# EAGLE design Timer Settings Schematic (EAGLE 9.2.2)
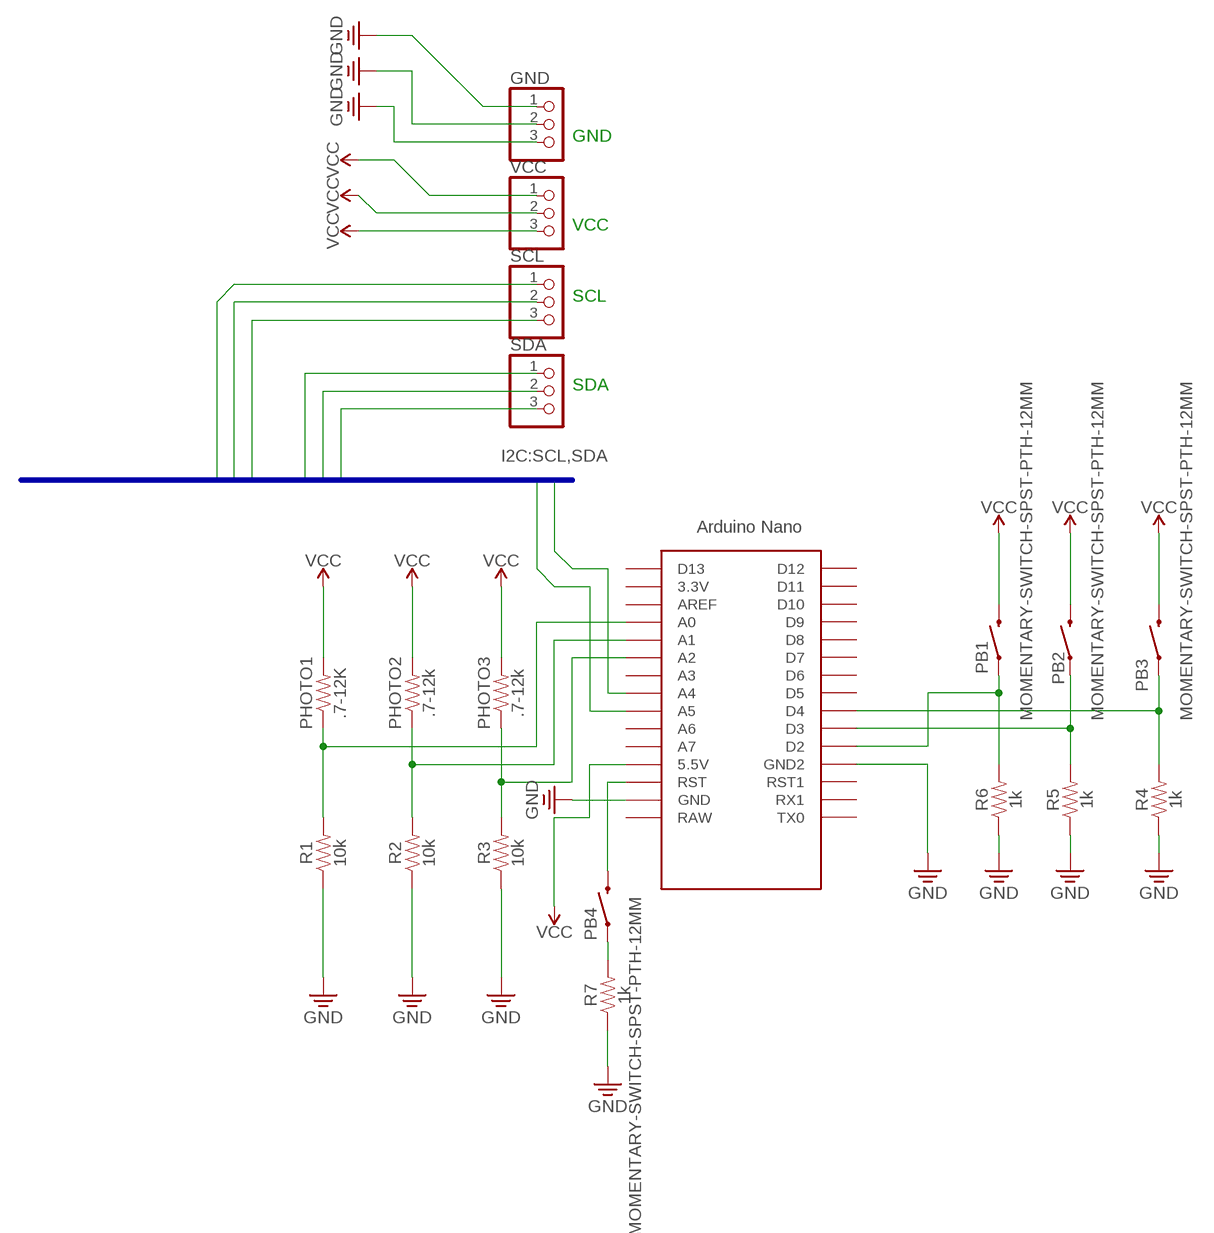
[diagram p0: schematic, sheet 1]

## Parts
GND  PINHD-1X3CB  [1X03-CLEANBIG]
PB1  MOMENTARY-SWITCH-SPST-PTH-12MM  [TACTILE_SWITCH_PTH_12MM]
PB2  MOMENTARY-SWITCH-SPST-PTH-12MM  [TACTILE_SWITCH_PTH_12MM]
PB3  MOMENTARY-SWITCH-SPST-PTH-12MM  [TACTILE_SWITCH_PTH_12MM]
PB4  MOMENTARY-SWITCH-SPST-PTH-12MM  [TACTILE_SWITCH_PTH_12MM]
PHOTO1  .7-12K  15KOHM-HORIZ-1/4W-5%  [AXIAL-0.3]
PHOTO2  .7-12k  15KOHM-HORIZ-1/4W-5%  [AXIAL-0.3]
PHOTO3  .7-12k  15KOHM-HORIZ-1/4W-5%  [AXIAL-0.3]
R1  10k  10KOHM-HORIZ-1/4W-1%  [AXIAL-0.3]
R2  10k  10KOHM-HORIZ-1/4W-1%  [AXIAL-0.3]
R3  10k  10KOHM-HORIZ-1/4W-1%  [AXIAL-0.3]
R4  1k  1KOHM-HORIZ-1/4W-1%  [AXIAL-0.3]
R5  1k  1KOHM-HORIZ-1/4W-1%  [AXIAL-0.3]
R6  1k  1KOHM-HORIZ-1/4W-1%  [AXIAL-0.3]
R7  1k  1KOHM-HORIZ-1/4W-1%  [AXIAL-0.3]
SCL  PINHD-1X3CB  [1X03-CLEANBIG]
SDA  PINHD-1X3CB  [1X03-CLEANBIG]
U$1  NANO  [NANO]
VCC  PINHD-1X3CB  [1X03-CLEANBIG]

## Nets
GND: GND.1 GND.2 GND.3 R1.P$1 R2.P$1 R3.P$1 R4.P$1 R5.P$1 R6.P$1 R7.P$1 U$1.GND U$1.GND1(GND2)
N$1: PB1.1 R6.P$2 U$1.D2
N$2: PB2.1 R5.P$2 U$1.D3
N$3: PB3.1 R4.P$2 U$1.D4
N$4: PHOTO3.P$1 R3.P$2 U$1.A2
N$5: PHOTO2.P$1 R2.P$2 U$1.A1
N$6: PHOTO1.P$1 R1.P$2 U$1.A0
N$7: PB4.1 R7.P$2
N$8: PB4.3 U$1.RST
SCL: SCL.1 SCL.2 SCL.3 U$1.A5
SDA: SDA.1 SDA.2 SDA.3 U$1.A4
VCC: PB1.3 PB2.3 PB3.3 PHOTO1.P$2 PHOTO2.P$2 PHOTO3.P$2 U$1.5V(5.5V) VCC.1 VCC.2 VCC.3
Unconnected: U$1.3.3V U$1.A3 U$1.A6 U$1.A7 U$1.AREF U$1.D5 U$1.D6 U$1.D7 U$1.D8 U$1.D9 U$1.D10 U$1.D11 U$1.D12 U$1.D13 U$1.ICSP1 U$1.ICSP2 U$1.ICSP3 U$1.ICSP4 U$1.ICSP5 U$1.ICSP6 U$1.RAW U$1.RST1 U$1.RX1 U$1.TX0

## Buses
I2C:SCL,SDA

## Notes on the sheet
- GND
- VCC
- SCL
- SDA

## Library data of the parts
GND SCL SDA VCC = adafruit:PINHD-1X3: PIN HEADER
PB1-PB4 = SparkFun-Switches:MOMENTARY-SWITCH-SPST: Momentary Switch (Pushbutton) - SPST Normally-open (NO) SPST momentary switches (buttons, pushbuttons). Variants PTH-12MM - 12mm square, through-hole Momentary Pushbutton Switch - 12mm Square <https://www.sparkfun.com/products/9190> (COM-09190) PTH-6.0MM, PTH-6.0MM-KIT - 6.0mm square, through-hole Mini Pushbutton Switch <https://www.sparkfun.com/products/97> (COM-00097) KIT package intended for soldering kit's - only one side of pads' copper is exposed. PTH-RIGHT-ANGLE-KIT - Right-angle, through-hole Right Angle Tactile Button <https://www.sparkfun.com/products/10791> - Used on SparkFun BigTime Watch Kit <https://www.sparkfun.com/products/11734> SMD-12MM - 12mm square, surface-mount Tactile Button - SMD (12mm) <https://www.sparkfun.com/products/12993> (COM-12993) Used on SparkFun PicoBoard <https://www.sparkfun.com/products/11888> SMD-4.5MM - 4.5mm Square Trackball Switch Used on SparkFun Blackberry Trackballer Breakout <https://www.sparkfun.com/products/13169> SMD-4.6MMX2.8MM - 4.60mm x 2.80mm, surface mount Used on SparkFun SAMD21 Mini Breakout <https://www.sparkfun.com/products/13664> SMD-5.2MM, SMD-5.2-REDUNDANT - 5.2mm square, surface-mount Mini Pushbutton Switch - SMD <https://www.sparkfun.com/products/8720> (COM-08720) Used on Arduino Pro Mini <https://www.sparkfun.com/products/11114> REDUNDANT package connects both switch circuits together SMD-6.0X3.5MM - 6.0 x 3.5mm, surface mount Momentary Reset Switch SMD <https://www.sparkfun.com/products/8229> (COM-08229) SMD-6.2MM-TALL - 6.2mm square, surface mount Tactile Button - SMD (6mm) <https://www.sparkfun.com/products/12992> Used on SparkFun Digital Sandbox <https://www.sparkfun.com/products/12651> SMD-RIGHT-ANGLE - Right-angle, surface mount Used on SparkFun Block for Intel® Edison - Arduino <https://www.sparkfun.com/products/13036>; PROD_ID: SWCH-09185; SF_SKU: COM-09190
PHOTO1-PHOTO3 = SparkFun-Resistors:15KOHM: 15kΩ resistor A resistor is a passive two-terminal electrical component that implements electrical resistance as a circuit element. Resistors act to reduce current flow, and, at the same time, act to lower voltage levels within circuits. - Wikipedia; PROD_ID: RES-11360; VALUE: 15k
R1-R3 = SparkFun-Resistors:10KOHM: 10kΩ resistor A resistor is a passive two-terminal electrical component that implements electrical resistance as a circuit element. Resistors act to reduce current flow, and, at the same time, act to lower voltage levels within circuits. - Wikipedia; PROD_ID: RES-12183
R4-R7 = SparkFun-Resistors:1KOHM: 1kΩ resistor A resistor is a passive two-terminal electrical component that implements electrical resistance as a circuit element. Resistors act to reduce current flow, and, at the same time, act to lower voltage levels within circuits. - Wikipedia; PROD_ID: RES-12182
U$1 = Arduino-clone:NANO: Arduino Nano

## Net classes
0 default: width 0.305 mm

## Board
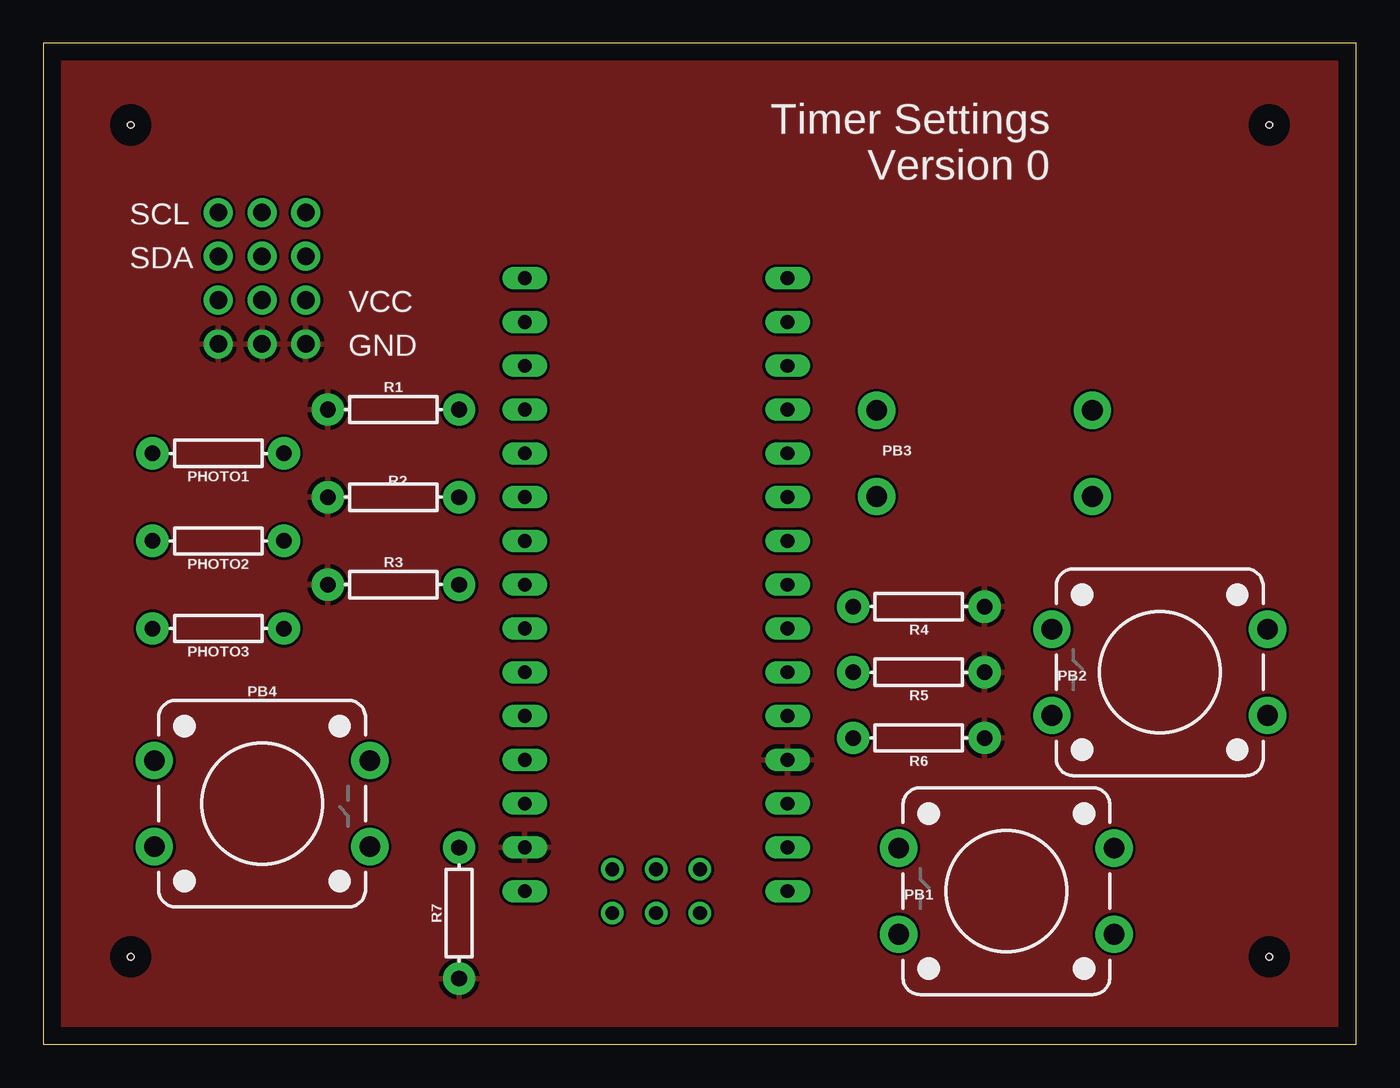
[diagram p1: board, top side]
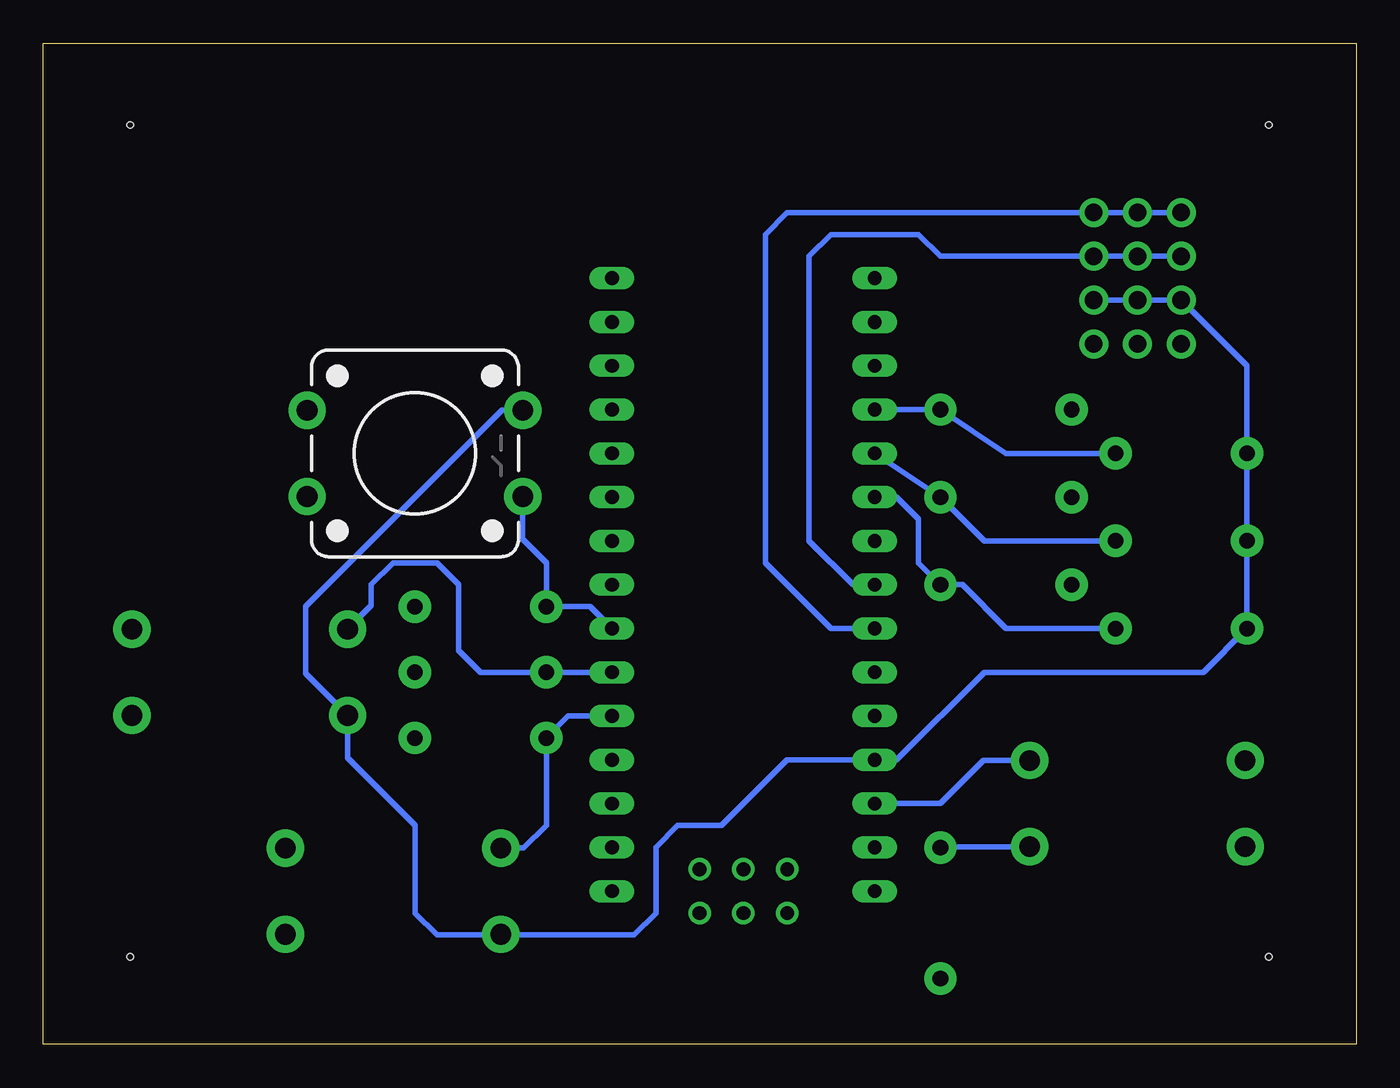
[diagram p2: board, bottom side, seen from below]

Size 76.18 x 58.09 mm. Coordinates in mm from the lower left corner, seen from the top.
Outline: 0,0 76.18,0 76.18,58.09 0,58.09 0,0
Copper layers (1*16): Top 0.035mm / dielectric 1.5mm / Bottom 0.035mm
Design rules "default": minimum track width 6mil, minimum drill 0.35mm, track to track 6mil, track to pad 6mil, pad to pad 6mil, via to via 6mil, smd to smd 6mil, copper to edge 40mil, drill to drill 6mil, minimum pad ring 10mil, minimum via ring 8mil, stop-mask expansion 4mil, vias tented up to drill 0mil, thermal gap 10mil
Holes 0.35 mm at 5.08,53.34 71.12,53.34 71.12,5.08 5.08,5.08

### Footprints (pad centres in the part's own frame; a part is rotated, then mirrored left to right if it is on the bottom)
1X03-CLEANBIG = drill 1.016 pad 1.676: 1 -2.54,0; 2 0,0; 3 2.54,0
TACTILE_SWITCH_PTH_12MM = drill 1.2 pad 2.159: 1 6.25,-2.5; 2 -6.25,-2.5; 3 6.25,2.5; 4 -6.25,2.5
AXIAL-0.3 = drill 0.9 pad 1.88: P$1 -3.81,0; P$2 3.81,0
NANO = drill 0.8 long: 3.3V -10.16,24.13; 5V -10.16,-1.27; A0 -10.16,19.05; A1 -10.16,16.51; A2 -10.16,13.97; A3 -10.16,11.43; A4 -10.16,8.89; A5 -10.16,6.35; A6 -10.16,3.81; A7 -10.16,1.27; AREF -10.16,21.59; D2 5.08,1.27; D3 5.08,3.81; D4 5.08,6.35; D5 5.08,8.89; D6 5.08,11.43; D7 5.08,13.97; D8 5.08,16.51; D9 5.08,19.05; D10 5.08,21.59; D11 5.08,24.13; D12 5.08,26.67; D13 -10.16,26.67; GND -10.16,-6.35; GND1 5.08,-1.27; RAW -10.16,-8.89; RST -10.16,-3.81; RST1 5.08,-3.81; RX1 5.08,-6.35; TX0 5.08,-8.89 | drill 0.8: ICSP1 -5.08,-10.16; ICSP2 -5.08,-7.62; ICSP3 -2.54,-10.16; ICSP4 -2.54,-7.62; ICSP5 0,-10.16; ICSP6 0,-7.62

### Placement (x,y rotation side)
GND  12.7,40.64 0 top
PB1  55.88,8.89 180 top
PB2  64.77,21.59 180 top
PB3  54.61,34.29 0 bottom
PB4  12.7,13.97 0 top
PHOTO1  10.16,34.29 180 top
PHOTO2  10.16,29.21 180 top
PHOTO3  10.16,24.13 180 top
R1  20.32,36.83 0 top
R2  20.32,31.75 0 top
R3  20.32,26.67 0 top
R4  50.8,25.4 180 top
R5  50.8,21.59 180 top
R6  50.8,17.78 180 top
R7  24.13,7.62 90 top
SCL  12.7,48.26 0 top
SDA  12.7,45.72 0 top
U$1  38.1,17.78 0 top
VCC  12.7,43.18 0 top

### Tracks (layer width: path | path; a pad name or v marks a point on that pad's centre or on a via)
GND
  pour Top: -2.54,69.85 -2.54,-2.54 77.47,-2.54 78.74,-1.27 78.74,71.12 77.47,69.85
N$1
  Bottom 0.305: PB1.1 48.3,11.39 46.99,12.7 R6.P$2 45.72,19.05 U$1.D2
N$2
  Bottom 0.305: U$1.D3 R5.P$2 50.8,21.59 52.07,22.86 52.07,26.67 53.34,27.94 55.88,27.94 57.15,26.67 57.15,25.46 PB2.1
N$3
  Bottom 0.305: U$1.D4 44.45,25.4 R4.P$2 46.99,27.94 48.36,29.31 PB3.1
N$4
  Bottom 0.305: U$1.A2 26.67,31.75 25.4,30.48 25.4,27.94 R3.P$2 22.86,26.67 20.32,24.13 PHOTO3.P$1
N$5
  Bottom 0.305: U$1.A1 R2.P$2 21.59,29.21 PHOTO2.P$1
N$6
  Bottom 0.305: PHOTO1.P$1 20.32,34.29 R1.P$2 U$1.A0
N$7
  Bottom 0.305: PB4.1 24.09,11.47 R7.P$2
N$8
  Bottom 0.305: PB4.3 21.63,16.47 24.13,13.97 U$1.RST
SCL
  Bottom 0.305: SCL.1 SCL.2 SCL.3 33.02,48.26 34.29,46.99 34.29,27.94 30.48,24.13 U$1.A5
SDA
  Bottom 0.305: SDA.1 SDA.2 SDA.3 24.13,45.72 25.4,46.99 30.48,46.99 31.75,45.72 31.75,29.21 29.21,26.67 U$1.A4
VCC
  Bottom 0.305: PB3.3 49.57,36.79 60.96,25.4 60.96,21.53 PB2.3 58.52,16.61 54.61,12.7 54.61,7.62 53.34,6.35 49.67,6.35 PB1.3 49.59,6.35 41.91,6.35 40.64,7.62 40.64,11.43 39.37,12.7 36.83,12.7 33.02,16.51 U$1.5V 26.67,16.51 21.59,21.59 8.89,21.59 PHOTO3.P$2 PHOTO2.P$2 PHOTO1.P$2 6.35,39.37 VCC.1 VCC.2 VCC.3

### Text on the board
tPlace: Timer Settings / Version 0